# EasyEDA Pro project ESD_System.eprj, schematic Schematic1
Board Name: Board1; Create Date: 2026-05-19; Page Name: P1; Project Name: ESD_System; Schematic Name: Schematic1; Update Date: 2026-06-06; Company: EasyEDA.com; Page Size: A4; Version: V1.0
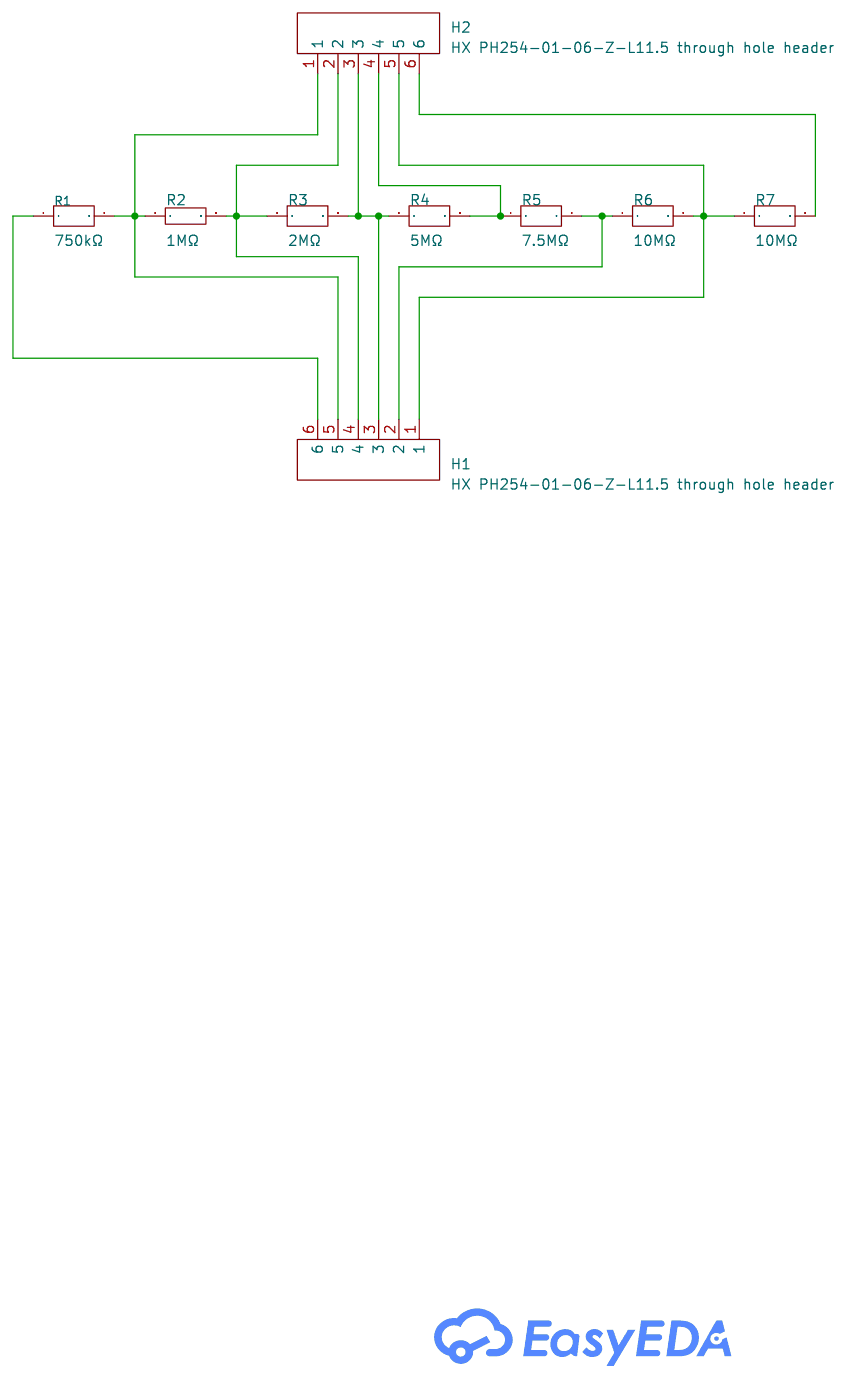
[diagram p0: schematic sheet]

## Parts
H1  HX PH254-01-06-Z-L11.5 through hole header  [HDR-TH_6P-P2.54-V-M]
H2  HX PH254-01-06-Z-L11.5 through hole header  [HDR-TH_6P-P2.54-V-M]
R1  750kΩ  [R0805]
R2  1MΩ  [R0805]
R3  2MΩ  [R0805]
R4  5MΩ  [R1206]
R5  7.5MΩ  [R0805]
R6  10MΩ  [R1206]
R7  10MΩ  [R1206]

## Library data of the parts
H1 H2 = HX PH254-01-06-Z-L11.5 through hole header: Pin Structure:1x6P Pitch:2.54mm Circluar Pins/Square Pins:Pin Header Mounting Type:Through Hole Number of Rows:1 Number of Pins:6P Current Rating:3A Voltage Rating (Max):1kV Length of Mating Pin:6mm Insulation Height:2.5mm Length of End Connection Pin:3mm; LCSC Part Name: 1x6P 间距:2.54mm 方针 直插; Supplier Part: C52016393; Manufacturer: hanxia(韩下); Supplier Footprint: 插件,P=2.54mm; JLCPCB Part Class: Extended Part; Datasheet: https://item.szlcsc.com/datasheet/HX%2520PH254-01-06-Z-L11.5%2520through%2520hole%2520header/54760438.html; Supplier: LCSC; Pin Structure: 1x6P; Pitch: 2.54mm; Circluar Pins/Square Pins: Pin Header; Mounting Type: Through Hole; Number of Rows: 1; Number of Pins: 6P; Current Rating: 3A; Voltage Rating (Max): 1kV; Length of Mating Pin: 6mm; Insulation Height: 2.5mm; Length of End Connection Pin: 3mm; Contact Material: Brass; Contact Plating: Gold; Operating Temperature: -40℃~+105℃
R1 = ERA6AEB754V: Type:Thin Film Resistor Resistance:750kΩ Tolerance:±0.1% Tolerance:±0.1% Power(Watts): Overload Voltage (Max): Temperature Coefficient:±25ppm/℃ Temperature Coefficient:±25ppm/℃ Operating Temperature Range:-55℃~+155℃ Operating Temperature Range:-55℃~+155℃; LCSC Part Name: 750kΩ ±0.1% 125mW 薄膜电阻; Supplier Part: C473330; Manufacturer: PANASONIC(松下); Supplier Footprint: 0805; JLCPCB Part Class: Extended Part; Datasheet: https://atta.szlcsc.com/upload/public/pdf/source/20200407/C473330_A657FCC088C3A794229BA1713F51D9CD.pdf; Supplier: LCSC; Type: Thin Film Resistor; Tolerance: ±0.1%; Temperature Coefficient: ±25ppm/℃; Operating Temperature Range: -55℃~+155℃
R2 = AR05BTCW1004: Type:Thin Film Resistor Resistance:1MΩ Tolerance:±0.1% Tolerance:±0.1% Power(Watts):125mW Voltage-Supply(Max):150V Temperature Coefficient:±25ppm/℃ Temperature Coefficient:±25ppm/℃ Operating Temperature:-55℃~+155℃ Operating Temperature:-55℃~+155℃; LCSC Part Name: 薄膜电阻 1MΩ ±0.1% 125mW; Supplier Part: C316223; Manufacturer: Viking(光颉); Supplier Footprint: 0805; JLCPCB Part Class: Extended Part; Datasheet: https://item.szlcsc.com/datasheet/AR05BTCW1004/297827.html; Supplier: LCSC; Type: Thin Film Resistor; Tolerance: ±0.1%; Power(Watts): 125mW; Voltage-Supply(Max): 150V; Temperature Coefficient: ±25ppm/℃; Operating Temperature: -55℃~+155℃
R3 = AR05BTCW2004: Type:Thin Film Resistor Resistance:2MΩ Tolerance:±0.1% Tolerance:±0.1% Power(Watts):125mW Voltage-Supply(Max):150V Temperature Coefficient:±25ppm/℃ Temperature Coefficient:±25ppm/℃ Operating Temperature:-55℃~+155℃ Operating Temperature:-55℃~+155℃; LCSC Part Name: 薄膜电阻 2MΩ ±0.1% 125mW; Supplier Part: C2984387; Manufacturer: Viking(光颉); Supplier Footprint: 0805; JLCPCB Part Class: Extended Part; Datasheet: https://item.szlcsc.com/datasheet/AR05BTCW2004/3425922.html; Supplier: LCSC; Type: Thin Film Resistor; Tolerance: ±0.1%; Power(Watts): 125mW; Voltage-Supply(Max): 150V; Temperature Coefficient: ±25ppm/℃; Operating Temperature: -55℃~+155℃
R4 = MCA1206MD5004BP500: Type:Thin Film Resistor Resistance:5MΩ Tolerance:±0.1% Tolerance:±0.1% Power(Watts):250mW Temperature Coefficient:±25ppm/℃ Temperature Coefficient:±25ppm/℃ Operating Temperature:-55℃~+155℃ Operating Temperature:-55℃~+155℃; LCSC Part Name: 薄膜电阻 5MΩ ±0.1% 250mW; Supplier Part: C3983762; Manufacturer: VISHAY(威世); Supplier Footprint: 1206; JLCPCB Part Class: Extended Part; Datasheet: https://item.szlcsc.com/datasheet/MCA1206MD5004BP500/4552950.html; Supplier: LCSC; Type: Thin Film Resistor; Tolerance: ±0.1%; Power(Watts): 250mW; Temperature Coefficient: ±25ppm/℃; Operating Temperature: -55℃~+155℃
R5 = MCU0805MD7504BP500: Type:Thin Film Resistor Resistance:7.5MΩ Tolerance:±0.1% Tolerance:±0.1% Power(Watts):200mW Temperature Coefficient:±25ppm/℃ Temperature Coefficient:±25ppm/℃ Operating Temperature:-55℃~+155℃ Operating Temperature:-55℃~+155℃; LCSC Part Name: 薄膜电阻 7.5MΩ ±0.1% 200mW; Supplier Part: C4326737; Manufacturer: VISHAY(威世); Supplier Footprint: 0805; JLCPCB Part Class: Extended Part; Datasheet: https://item.szlcsc.com/datasheet/MCU0805MD7504BP500/4897190.html; Supplier: LCSC; Type: Thin Film Resistor; Tolerance: ±0.1%; Power(Watts): 200mW; Temperature Coefficient: ±25ppm/℃; Operating Temperature: -55℃~+155℃
R6 R7 = MCA1206MD1005BP500: Type:Thin Film Resistor Resistance:10MΩ Tolerance:±0.1% Tolerance:±0.1% Power(Watts):250mW Temperature Coefficient:±25ppm/℃ Temperature Coefficient:±25ppm/℃ Operating Temperature:-55℃~+155℃ Operating Temperature:-55℃~+155℃; LCSC Part Name: 薄膜电阻 10MΩ ±0.1% 250mW; Supplier Part: C4267800; Manufacturer: VISHAY(威世); Supplier Footprint: 1206; JLCPCB Part Class: Extended Part; Datasheet: https://item.szlcsc.com/datasheet/MCA1206MD1005BP500/4838231.html; Supplier: LCSC; Type: Thin Film Resistor; Tolerance: ±0.1%; Power(Watts): 250mW; Temperature Coefficient: ±25ppm/℃; Operating Temperature: -55℃~+155℃

## Nets
$1N1897: H1.5 H2.1 R1.2 R2.1
$1N1901: H1.4 H2.2 R2.2 R3.1
$1N1906: H1.3 H2.3 R3.2 R4.1
$1N2059: H1.6 R1.1
Net-(H1-1): H1.1 H2.5 R6.2 R7.1
Net-(H1-2): H1.2 R5.2 R6.1
Net-(H2-4): H2.4 R4.2 R5.1
Net-(H2-6): H2.6 R7.2
